# Altium schematic sheet Xbee_Router.SchDoc
size 250 x 149 mm; DocumentNumber: 2; SheetNumber: 2; SheetTotal: 2
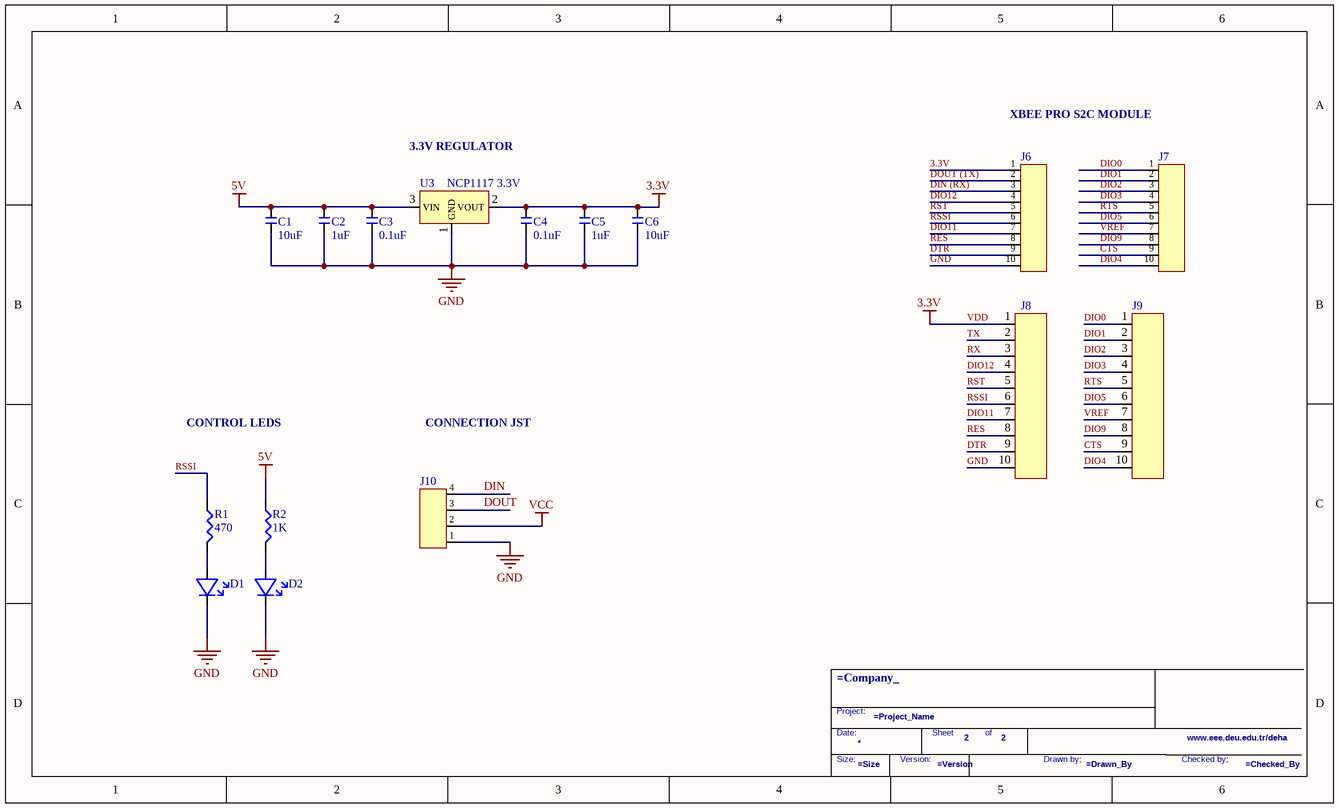
[diagram p0: Xbee_Router.SchDoc]

## Parts
*?  TitleBlock  (value not drawn)  (graphical)
C1  10uF  [C_1206]
C2  1uF  [C_1206]
C3  0.1uF  [C_1206]
C4  0.1uF  [C_1206]
C5  1uF  [C_1206]
C6  10uF  [C_1206]
D1  LED_0805  [LED_0805]  (value not drawn)
D2  LED_0805  [LED_0805]  (value not drawn)
J6  Header_1x10_2mm  [Header 1x10 2mm]  (value not drawn)
J7  Header_1x10_2mm  [Header 1x10 2mm]  (value not drawn)
J8  Pin_Header_1x10Pos_2.54mm  [PinHeader_1x10Pin_2.54mm]  (value not drawn)
J9  Pin_Header_1x10Pos_2.54mm  [PinHeader_1x10Pin_2.54mm]  (value not drawn)
J10  JST_Header_1x4Pos_2.54mm  [JST Header_1x4Pin_2.54mm]  (value not drawn)
R1  470  [R_1206]
R2  1K  [R_1206]
U3  NCP1117 3.3V  [NCP1117 3.3V]

## Nets
3.3V: C4.2 C5.2 C6.2 J6.1 J8.1 U3.2(VOUT)  [also labelled VDD]
5V: C1.2 C2.2 C3.2 R2.1 U3.3(VIN)
GND: C1.1 C2.1 C3.1 C4.1 C5.1 C6.1 D1.2 D2.2 J6.10 J8.10 J10.1 U3.1(GND)
VCC: J10.2
CTS: J7.9 J9.9
DIN: J10.4
DIN (RX): J6.3
DIO0: J7.1 J9.1
DIO1: J7.2 J9.2
DIO2: J7.3 J9.3
DIO3: J7.4 J9.4
DIO4: J7.10 J9.10
DIO5: J7.6 J9.6
DIO9: J7.8 J9.8
DIO11: J6.7 J8.7
DIO12: J6.4 J8.4
DOUT: J10.3
DOUT (TX): J6.2
DTR: J6.9 J8.9
RES: J6.8 J8.8
RSSI: J6.6 J8.6 R1.1
RST: J6.5 J8.5
RTS: J7.5 J9.5
RX: J8.3
TX: J8.2
VREF: J7.7 J9.7
NetD1_1: D1.1 R1.2
NetD2_1: D2.1 R2.2

## Notes on the sheet
- 3.3V REGULATOR
- XBEE PRO S2C MODULE
- CONTROL LEDS
- CONNECTION JST
- (in symbol TitleBlock) Project:; Date:; Sheet; of; www.eee.deu.edu.tr/deha; Size:; Version:; Drawn by;; Checked by;

## Library data of the parts
C1-C6 = C_1206(3216): 1206(3216) package capacitor
R1 R2 = R_1206(3216): 1206(3216) package resistor
U3 = NCP1117 3.3V: NCP1117-3.3V Linear Regulator